# Altium schematic sheet interfaces.schdoc
size 209 x 297 mm; Scale: 1:1; DocumentType: Ñõåìà ýëåêòðè÷åñêàÿ ïðèíöèïèàëüíàÿ; FirstReferrence: ÀÁÂÃ.123456.001; PageSetup: Record=PageOptions¦CenterHorizontal=False¦CenterVertical=False¦PrintScale=0.95¦XCorrection=0.00¦YCorrection=0.00¦PrintKind=1¦BorderSize=5000000¦LeftOffset=0¦BottomOffset=0¦Orientation=1¦PaperLength=1000¦PaperWidth=1000¦Scale=100¦PaperSource=15¦PrintQuality=600¦MediaType=1¦DitherType=10¦PaperKind=A4¦PrintScaleMode=1
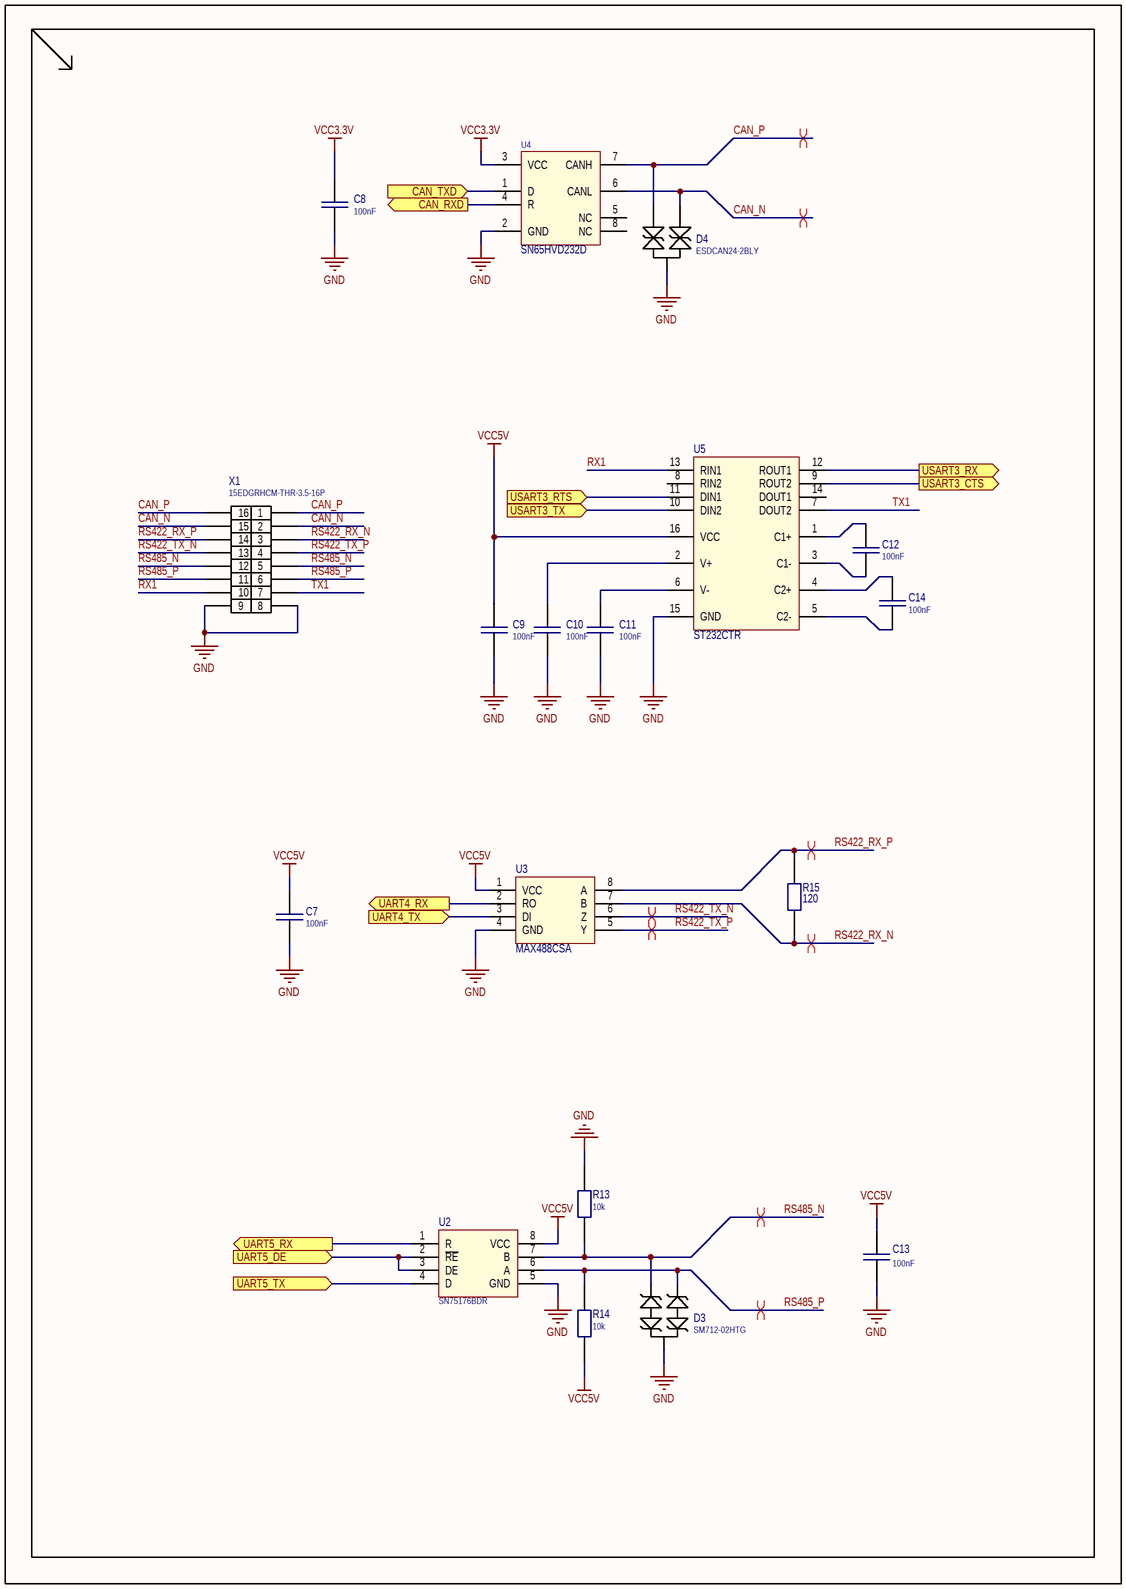
[diagram p0: interfaces.schdoc]

## Parts
C7  100nF  [C_0603]
C8  100nF  [C_0603]
C9  100nF  [C_0603]
C10  100nF  [C_0603]
C11  100nF  [C_0603]
C12  100nF  [C_0603]
C13  100nF  [C_0603]
C14  100nF  [C_0603]
D3  SM712-02HTG  [SOT23]
D4  ESDCAN24-2BLY  [SOT23]
R13  10k  [R_0603]
R14  10k  [R_0603]
R15  120  [R_0603]
U2  SN75176BDR  [SO-8]
U3  MAX488CSA  [SO-8_M]
U4  SN65HVD232D  [SO-8_M]
U5  ST232CTR  [TSSOP16_STM]
X1  15EDGRHCM-THR-3.5-16P  [DMC 1,5/ 8-G1F-3,5-LR P20THR / 1787072]

## Ports
CAN_RXD (out), CAN_TXD (in), UART4_RX (out), UART4_TX (in), UART5_DE (in), UART5_RX (out), UART5_TX (in), USART3_CTS (out), USART3_RTS (in), USART3_RX (out), USART3_TX (in)

## Nets
GND: C7.1 C8.1 C9.1 C10.1 C11.1 C13.1 D3.3 D4.3 R13.2 U2.5(GND) U3.4(GND) U4.2(GND) U5.15(GND) X1.8 X1.9
VCC3.3V: C8.2 U4.3(VCC)
VCC5V: C7.2 C9.2 C13.2 R14.1 U2.8(VCC) U3.1(VCC) U5.16(VCC)
CAN_N: D4.2 U4.6(CANL) X1.2 X1.15
CAN_P: D4.1 U4.7(CANH) X1.1 X1.16
CAN_RXD: U4.4(R) ; port CAN_RXD
CAN_TXD: U4.1(D) ; port CAN_TXD
RS422_RX_N: R15.2 U3.7(B) X1.3
RS422_RX_P: R15.1 U3.8(A) X1.14
RS422_TX_N: U3.6(Z) X1.13
RS422_TX_P: U3.5(Y) X1.4
RS485_N: D3.1 R13.1 U2.7(B) X1.5 X1.12
RS485_P: D3.2 R14.2 U2.6(A) X1.6 X1.11
RX1: U5.13(RIN1) X1.10
TX1: U5.7(DOUT2) X1.7
UART4_RX: U3.2(RO) ; port UART4_RX
UART4_TX: U3.3(DI) ; port UART4_TX
UART5_DE: U2.2(~{RE}) U2.3(DE) ; port UART5_DE
UART5_RX: U2.1(R) ; port UART5_RX
UART5_TX: U2.4(D) ; port UART5_TX
USART3_CTS: U5.9(ROUT2) ; port USART3_CTS
USART3_RTS: U5.11(DIN1) ; port USART3_RTS
USART3_RX: U5.12(ROUT1) ; port USART3_RX
USART3_TX: U5.10(DIN2) ; port USART3_TX
NetC10_2: C10.2 U5.2(V+)
NetC11_2: C11.2 U5.6(V-)
NetC12_1: C12.1 U5.1(C1+)
NetC12_2: C12.2 U5.3(C1-)
NetC14_1: C14.1 U5.4(C2+)
NetC14_2: C14.2 U5.5(C2-)

Not connected (* = marked no-connect by the designer): U4 5(NC) 8(NC); U5 8(RIN2) 14(DOUT1)

## Layout directives
differential pair: CAN_N, CAN_P, RS422_RX_N, RS422_RX_P, RS422_TX_N, RS422_TX_P, RS485_N, RS485_P

## Library data of the parts
C7-C14 = C0603: Capacitor; Part Number: CC0603JPX7R9BB104; Value: 100nF
D3 = ESD: Value: SM712-02HTG; Part Number: SM712-02HTG; Alternative Part: *
D4 = ESD_CAN: ESD; Value: ESDCAN24-2BLY; Part Number: ESDCAN24-2BLY; Alternative Part: *
R13 R14 = RES_SMD: Resistor; Part Number: RC0603FR-0710KL; Alternative Part: *; Value: 10k
R15 = RES_SMD: Resistor; Part Number: RC0603FR-07120RL; Alternative Part: *; Value: 120
U2 = SN75176BDR: RS485 Half Duplex Convertor; Part Number: SN75176BDR
U3 = ADM4855ARZ: RS485 Full Duplex Convertor; Part Number: MAX488CSA
U4 = SN65HVD232D: CAN_transiever; Part Number: SN65HVD232DR; Alternative Part: XL1050
U5 = ST232CTR: No Description Available; Mfr_Name: STMicroelectronics; Alternative Part: SP3232EEY-L/TR; Copyright: Copyright (C) 2022 Ultra Librarian. All rights reserved.; Part Number: ST232CTR; RefDes: RefDes; Type: DEV
X1 = DMC 1,5/ 8-G1F-3,5-LR P20THR / 1787072: Part Number: 15EDGRHCM-THR-3.5-16P